# Altium schematic sheet 04_VOLTAGE_CONVERTER.SchDoc: =TitleParameter
size A3; Address: Crete IL; Organization: ASISGUARD; Address1: Kemalpasa, Kemalpasa Cd. No:290 D:292H, 35060 Bornova/Izmir/Turkey
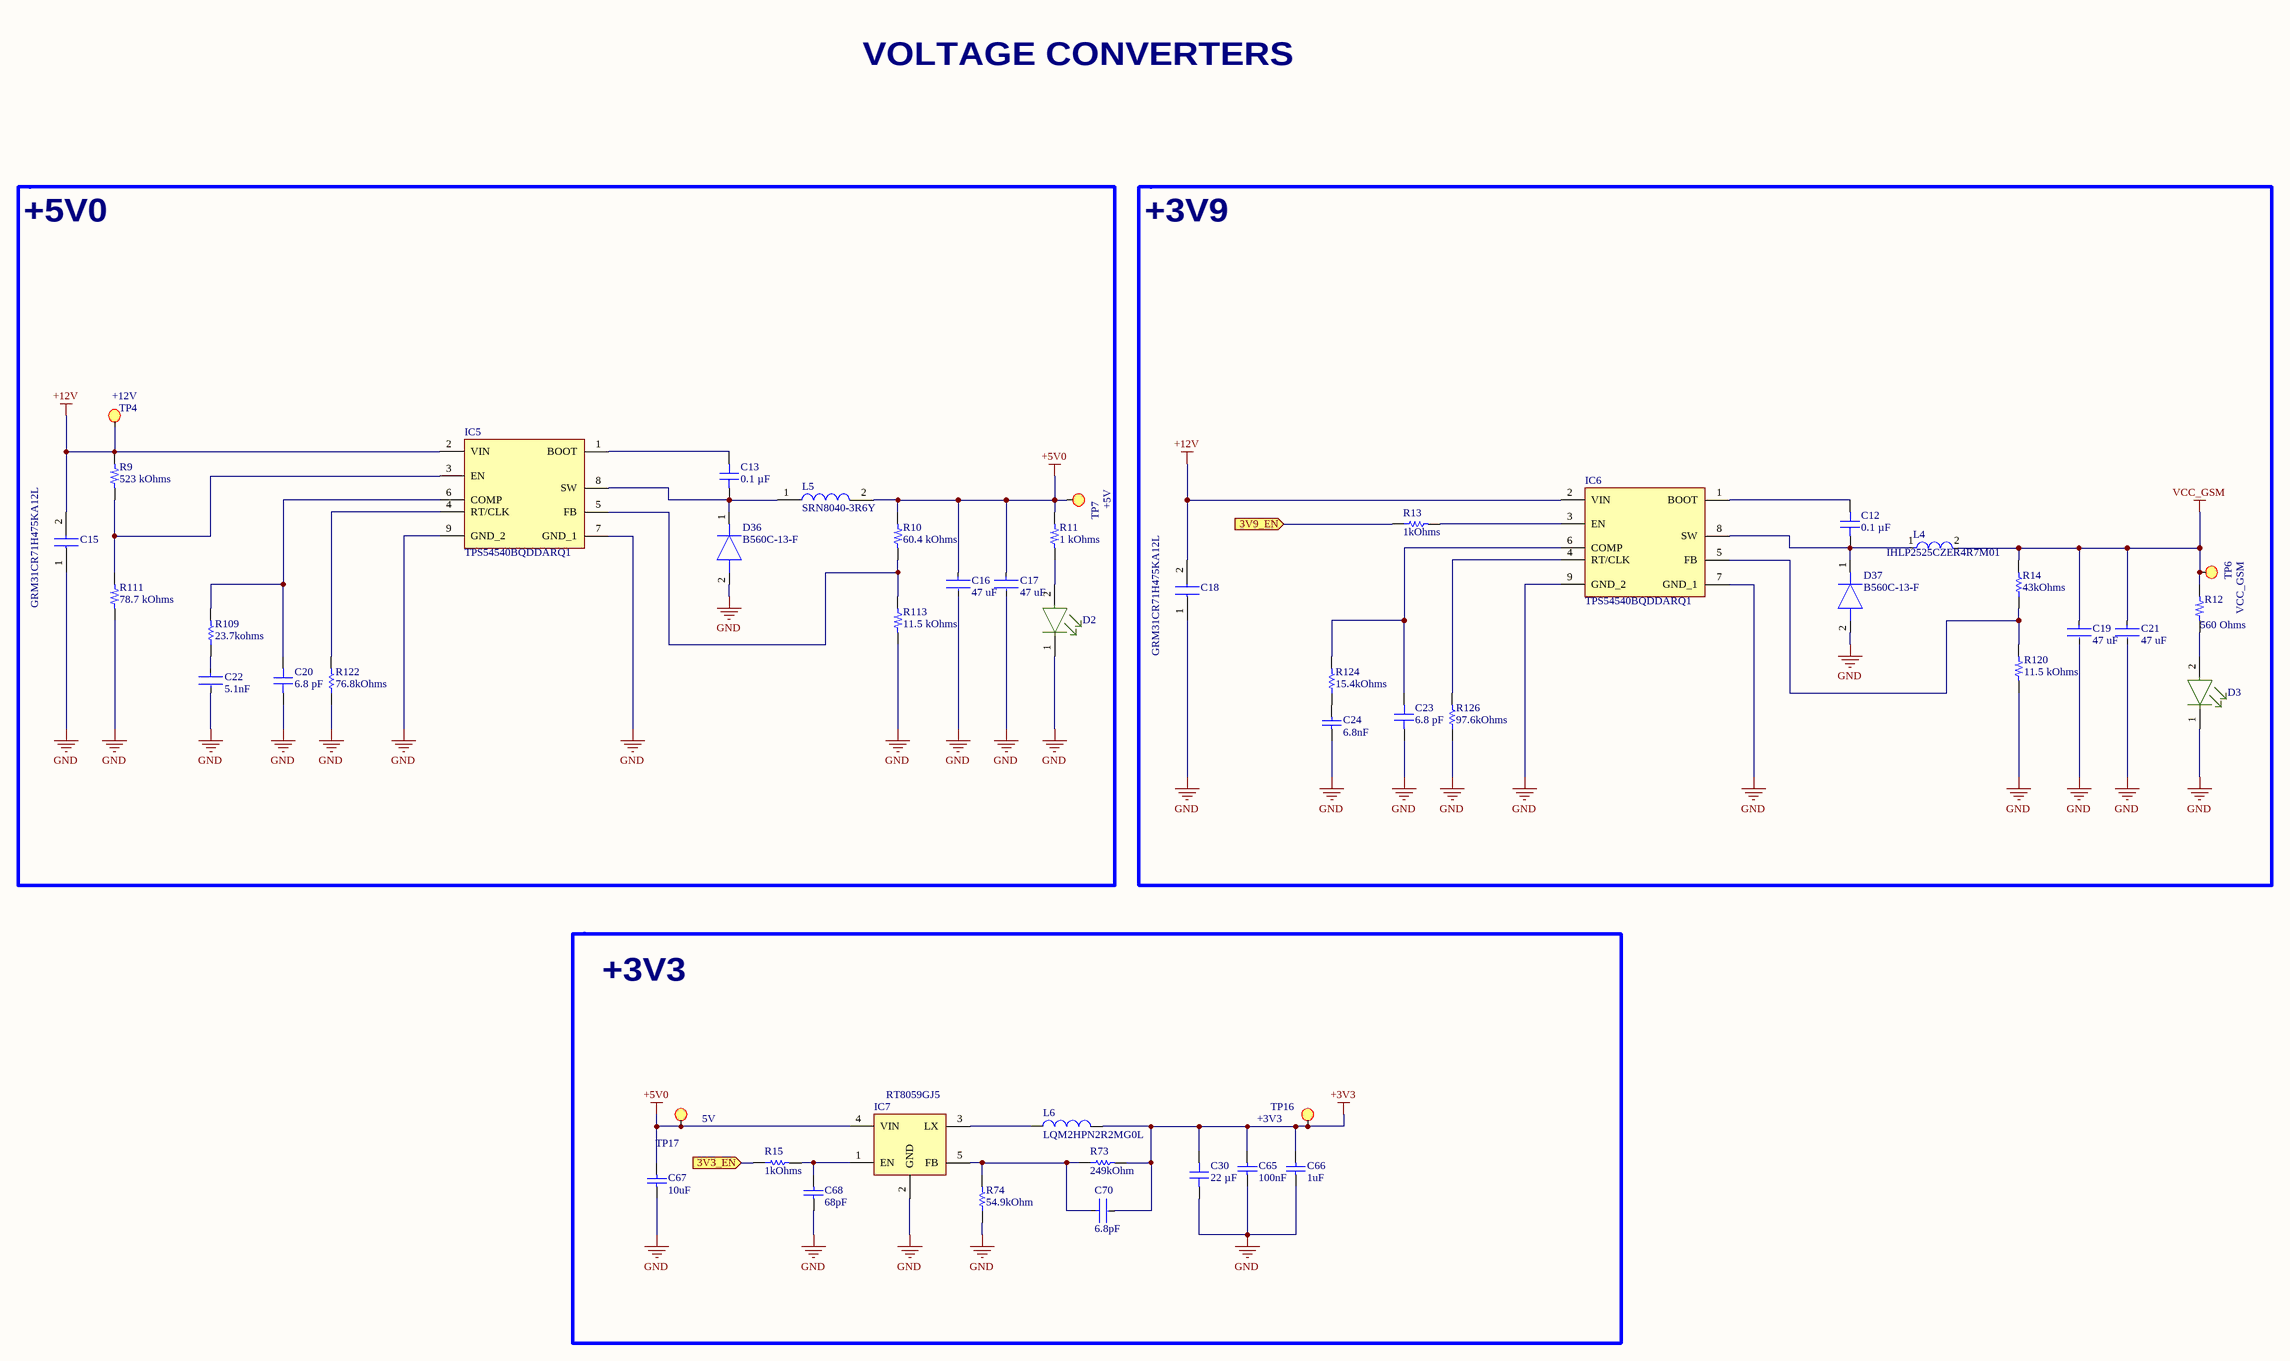
[diagram p0: 04_VOLTAGE_CONVERTER.SchDoc]

## Parts
C12  0.1 µF  [CAP0402(1005)X0.5]
C13  0.1 µF  [CAP0402(1005)X0.5]
C15  GRM31CR71H475KA12L  [CAPC3216X180N]
C16  47 uF  [FP-GRM32E-0_3-0_2-IPC_C]
C17  47 uF  [FP-GRM32E-0_3-0_2-IPC_C]
C18  GRM31CR71H475KA12L  [CAPC3216X180N]
C19  47 uF  [FP-GRM32E-0_3-0_2-IPC_C]
C20  6.8 pF  [CAP0603]
C21  47 uF  [FP-GRM32E-0_3-0_2-IPC_C]
C22  5.1nF  [FP-C0603C-CF-MFG]
C23  6.8 pF  [CAP0603]
C24  6.8nF  [CAPC1608X90X35NL10T15]
C30  22 µF  [CAP1206]
C65  100nF  [CAP0603]
C66  1uF  [CAP0603]
C67  10uF  [CAP0603]
C68  68pF  [CAP0603]
C70  6.8pF  [FP-C0603C-CF-MFG]
D2  LED GREEN CLEAR SMD  [Lite-On_GREEN_MFG]  (value not drawn)
D3  LED GREEN CLEAR SMD  [Lite-On_GREEN_MFG]  (value not drawn)
D36  B560C-13-F  [DIOM7959X250N]
D37  B560C-13-F  [DIOM7959X250N]
IC5  TPS54540BQDDARQ1  [SOIC127P600X170-9N]
IC6  TPS54540BQDDARQ1  [SOIC127P600X170-9N]
IC7  RT8059GJ5  [SOT94P280X100-5N]
L4  IHLP2525CZER4R7M01  [FP-IHLP-2525CZ-FP_2_413x3-MFG]
L5  SRN8040-3R6Y  [SRN8040-3R3Y]
L6  LQM2HPN2R2MG0L  [INDC2520X100N]
R9  523 kOhms  [RES0402(1005)]
R10  60.4 kOhms  [RES0402(1005)]
R11  1 kOhms  [RES 0603_1608]
R12  560 Ohms  [RES 0402_1005]
R13  1kOhms  [RESC1005X40X25LL05T10]
R14  43kOhms  [RESC1005X40X25NL05T05]
R15  1kOhms  [RESC1005X40X25LL05T10]
R73  249kOhm  [RESC1005X40X25NL05T05]
R74  54.9kOhm  [RESC1005X40X25LL05T10]
R109  23.7kohms  [RESC1005X40X25ML05T05]
R111  78.7 kOhms  [RES0402(1005)]
R113  11.5 kOhms  [RES0402(1005)]
R120  11.5 kOhms  [RES0402(1005)]
R122  76.8kOhms  [RESC1609X50X30ML10T20]
R124  15.4kOhms  [RESC1005X40X25ML05T05]
R126  97.6kOhms  [RESC1005X40X25ML05T10]
TP4  +12V  [TEST_POINT_SMD]
TP6  VCC_GSM  [TEST_POINT_SMD]
TP7  +5V  [TEST_POINT_SMD]
TP16  +3V3  [TEST_POINT_SMD]
TP17  5V  [TEST_POINT_SMD]

## Blocks framed on the sheet
+5V0: C13 C15-C17 C20 C22 D2 D36 IC5 L5 R9-R11 R109 R111 R113 R122 TP4 TP7
+3V9: C12 C18 C19 C21 C23 C24 D3 D37 IC6 L4 R12-R14 R120 R124 R126 TP6
+3V3: C30 C65-C68 C70 IC7 L6 R15 R73 R74 TP16 TP17

## Ports
3V3_EN (in), 3V9_EN (in)

## Nets
+3V3: C30.2 C65.2 C66.2 C70.2 L6.2 R73.2 TP16.1(TP)
+5V0: C16.1 C17.1 C67.1 IC7.4(VIN) L5.2 R10.2 R11.2 TP7.1(TP) TP17.1(TP)
+12V: C15.2 C18.2 IC5.2(VIN) IC6.2(VIN) R9.2 TP4.1(TP)
GND: C15.1 C16.2 C17.2 C18.1 C19.2 C20.1 C21.2 C22.2 C23.1 C24.1 C30.1 C65.1 C66.1 C67.2 C68.2 D2.1(C) D3.1(C) D36.2(A) D37.2(A) IC5.7(GND_1) IC5.9(GND_2) IC6.7(GND_1) IC6.9(GND_2) IC7.2(GND) R74.1 R111.1 R113.1 R120.1 R122.1 R126.1
VCC_GSM: C19.1 C21.1 L4.2 R12.2 R14.2 TP6.1(TP)
3V3_EN: R15.1 ; port 3V3_EN
3V9_EN: R13.1 ; port 3V9_EN
NetC12_1: C12.1 D37.1(K) IC6.8(SW) L4.1
NetC12_2: C12.2 IC6.1(BOOT)
NetC13_1: C13.1 D36.1(K) IC5.8(SW) L5.1
NetC13_2: C13.2 IC5.1(BOOT)
NetC20_2: C20.2 IC5.6(COMP) R109.2
NetC22_1: C22.1 R109.1
NetC23_2: C23.2 IC6.6(COMP) R124.2
NetC24_2: C24.2 R124.1
NetC68_1: C68.1 IC7.1(EN) R15.2
NetC70_1: C70.1 IC7.5(FB) R73.1 R74.2
NetD2_2: D2.2(A) R11.1
NetD3_2: D3.2(A) R12.1
NetIC5_3: IC5.3(EN) R9.1 R111.2
NetIC5_4: IC5.4(RT/CLK) R122.2
NetIC5_5: IC5.5(FB) R10.1 R113.2
NetIC6_3: IC6.3(EN) R13.2
NetIC6_4: IC6.4(RT/CLK) R126.2
NetIC6_5: IC6.5(FB) R14.1 R120.2
NetIC7_3: IC7.3(LX) L6.1

## Notes on the sheet
- VOLTAGE CONVERTERS
- Proje/Project:
- Sayfa Adı/Document Name:
- Çizilme Tarihi/Drawing Date
- Umit KAYACIK
- Tasarlayan/Designed By
- Sayfa/Sheet:
- Revision:
- of
- Son Güncelleme/Last Edit Date
- Kontrol eden/Checked By
- Onaylayan/Approved By
- Boyut/Size:
- Varyant/Variant:
- Dil/Language:
- A3
- ENG

## Library data of the parts
C12 C13 = C0402C104K4RECAUTO: CAP CER 0402 0.1UF 16V X7R 10%; manufacturer: KEMET; Part Number: C0402C104K4RECAUTO; Value: 0.1 µF; Applications: Automotive, ESD Protection; Capacitance: 0.1 µF; componentlink1description: Datasheet; componentlink1url: https://api.kemet.com/component-edge/download/datasheet/C0402C104K4RECAUTO.pdf; componentlink2description: DigiKey Link; componentlink2url: https://www.digikey.com/en/products/detail/kemet/C0402C104K4RECAUTO/8563695; Device Package: 0402 (1005 Metric); lastupdated: 2/9/2024 8:04:38 PM; Lifecycle Status: Active; Minimum Order: 1; Mounting Type: Surface Mount, MLCC; Operating Temperature: -55°C ~ 125°C; Package / Case: 0402 (1005 Metric); packaging: TapeAndReel; partid: 1731; Part Status: Active; price: 0.01; Ratings: AEC-Q200; series: ESD SMD Auto X7R; Size / Dimension: 0.039" L x 0.020" W (1.00mm x 0.50mm); Supplier 1: DigiKey; Supplier Part Number 1: 399-17167-1-ND; Temperature Coefficient: X7R; Thickness (Max): 0.022" (0.55mm); Tolerance: ±10%; Voltage - Rated: 16V
C15 C18 = GRM31CR71H475KA12L: Capacitor; Manufacturer_Name: Murata Electronics; Datasheet Link: https://search.murata.co.jp/Ceramy/image/img/A01X/G101/ENG/GRM31CR71H475KA12-01A.pdf; Height: 1.8mm; Manufacturer_Part_Number: GRM31CR71H475KA12L; Mouser Part Number: 81-GRM31CR71H475KA2L; Mouser Price/Stock: https://www.mouser.co.uk/ProductDetail/Murata-Electronics/GRM31CR71H475KA12L?qs=QOxk%252BkhTc6I%252BVQUsJuOHog%3D%3D; Arrow Part Number: GRM31CR71H475KA12L; Arrow Price/Stock: https://www.arrow.com/en/products/grm31cr71h475ka12l/murata-manufacturing?utm_currency=USD&region=nac
C16 C17 C19 C21 = CMP-2000-06362-2: CAP CER 47UF 16V X5R 1210; Part Number: GRM32ER61C476KE15L; Tolerance: 10%; Material: Ceramic; Case Code (Metric): 3225; RoHS Compliant: Yes; Min Operating Temperature: -55°C; Radiation Hardening: No; Voltage: 16V; Package Quantity: 1; Case Code (Imperial): 1210; REACH SVHC: No SVHC; Capacitance: 47uF; Voltage Rating (DC): 16V; Dielectric: X5R; Case/Package: 1210; Length: 3.2mm; Voltage Rating: 16V; Packaging: Cut Tape; Width: 0.098inch; Number of Pins: 2; Lead Free: Lead Free; Height: 2.5mm; Mount: Surface Mount; Termination: SMD/SMT; Max Operating Temperature: 85°C; Thickness: 0.106inch; Depth: 2.5mm
C20 C23 = 06031U6R8BAT2A: CAP CER 6.8PF 100V NP0 0603; manufacturer: KYOCERA AVX; Temperature Coefficient: C0G, NP0; Tolerance: ±0.1pF; Part Number: 06031U6R8BAT2A; Value: 6.8 pF; Applications: RF, Microwave, High Frequency; Capacitance: 6.8 pF; componentlink1description: Datasheet; componentlink1url: https://datasheets.kyocera-avx.com/U-Series.pdf; componentlink2description: DigiKey Link; componentlink2url: https://www.digikey.com/en/products/detail/kyocera-avx/06031U6R8BAT2A/1598953; Device Package: 0603 (1608 Metric); Features: Ultra Low ESR; lastupdated: 2/9/2024 8:09:59 PM; Lifecycle Status: Active; Minimum Order: 1; Mounting Type: Surface Mount, MLCC; Operating Temperature: -55°C ~ 125°C; Package / Case: 0603 (1608 Metric); packaging: TapeAndReel; partid: 35837; Part Status: Active; price: 0.05; series: U; Size / Dimension: 0.060" L x 0.030" W (1.52mm x 0.76mm); Supplier 1: DigiKey; Supplier Part Number 1: 478-06031U6R8BAT2ACT-ND; Thickness (Max): 0.036" (0.91mm); Voltage - Rated: 100V
C22 = CMP-1035-02216-3: CAP CER 5100PF 50V C0G/NP0 0603; Manufacturer: KEMET; Manufacturer Part Number: C0603C512J5GACTU; Tolerance: 0.05; Material: Ceramic; Value: 5,100 pF; Temperature Characteristic: C0G; Temperature Coefficient: 30ppm/°C; Automotive Grade: Grade 1; Mouser Description: Multilayer Ceramic Capacitors MLCC - SMD/SMT 50volts 5100pF 5% C0G; Lead Free: Yes; Digikey Description: CAP CER 5100PF 50V C0G/NP0 0603; ComponentLink2URL: https://api.kemet.com/component-edge/download/datasheet/C0603C100J5GACAUTO.pdf; Octopart: https://octopart.com/c0603c512j5gactu-kemet-19757382; Device Class L2: Capacitors; Automotive: Yes; ComponentLink2Description: Datasheet; Voltage Rating: 50 V; Temperature Range High: +125°C; Temperature Range Low: -55°C; RoHS: TRUE; Capacitance: 5,100 pF; Temperature: -55°C to +125°C; Package: C0603C-CF; Device Class L1: Passive Components; Height: 0.87mm; Device Class L3: Ceramic Capacitors; Category: Cap; Part Number: C0603C512J5GACTU
C24 = CMP-2006-02958-1: Part Number: GRM188R72A682KA01D; Manufacturer: Murata
C30 = CL31A226KAHNNNE: CAP CER 22UF 25V X5R 1206; manufacturer: Samsung Electro-Mechanics; Tolerance: ±10%; Part Number: CL31A226KAHNNNE; Value: 22 µF; Applications: General Purpose; Capacitance: 22 µF; componentlink1description: Datasheet; componentlink1url: http://www.samsungsem.com/kr/support/product-search/mlcc/CL31A226KAHNNNE.jsp; componentlink2description: DigiKey Link; componentlink2url: https://www.digikey.com/en/products/detail/samsung-electro-mechanics/CL31A226KAHNNNE/3888705; Device Package: 1206 (3216 Metric); lastupdated: 3/11/2024 7:11:00 AM; Lifecycle Status: Active; Minimum Order: 1; Mounting Type: Surface Mount, MLCC; Operating Temperature: -55°C ~ 85°C; Package / Case: 1206 (3216 Metric); packaging: TapeAndReel; partid: 22185; Part Status: Active; price: 0.07; series: CL; Size / Dimension: 0.126" L x 0.063" W (3.20mm x 1.60mm); Supplier 1: DigiKey; Supplier Part Number 1: 1276-3047-1-ND; Temperature Coefficient: X5R; Thickness (Max): 0.071" (1.80mm); Voltage - Rated: 25V
C65 = CAP0603_100nF: CAP CER 0.1UF 50V X7R 0603; Part Number: C0603C104K5RACTU; Value: 100nF 50V; Order Code: DIGI : 399-5089-1-ND
C66 = CAP0603_100nF: CAP CER 1uF 25V X7R 0603; Part Number: CGA3E1X7R1E105K080AE; Value: 1uF 25V; Order Code: DIGI : 445-173628-2-ND
C67 = CAP0603_100nF: Ceramic Capacitor,10uF,16V,+/-20%,X5R,0603,Samsung; P/N: CL10A106MONQNC; Value: 10uF 16V
C68 = CAP0603_100nF: 68 pF ±2% 50V Ceramic Capacitor C0G, NP0 0603 (1608 Metric); Part Number: 06035A680GAT2A; Value: 68pF 50V; Order Code: DIGI : 478-10332-2-ND
C70 = CMP-2006-03271-2: CAP CER 6.8PF 50V NP0 0603; Manufacturer Part Number: C0603C689C5GACTU; Manufacturer: KEMET; Automotive Grade: Grade 1; Temperature Coefficient: 30ppm/°C; Temperature Characteristic: C0G; Tolerance: 0.25 pF; Material: Ceramic; ComponentLink2URL: https://api.kemet.com/component-edge/download/datasheet/C0603C100J5GACAUTO.pdf; Mouser Description: 0603 C 6.8pF Ceramic Multilayer Capacitor; 50V dc; +125C; C0G Dielectric; +/-0.25pF; Temperature Range High: +125°C; Device Class L1: Passive Components; Temperature: -55°C to +125°C; Digikey Description: CAP CER 6.8PF 50V NP0 0603; Device Class L2: Capacitors; Automotive: Yes; Octopart: https://octopart.com/c0603c689c5gactu-kemet-8718591; Category: Cap; ComponentLink2Description: Datasheet; RoHS: TRUE; Capacitance: 6.8 pF; Value: 6.8 pF; Lead Free: Yes; Device Class L3: Ceramic Capacitors; Package: C0603C-CF; Voltage Rating: 50 V; Temperature Range Low: -55°C; Height: 0.87mm; Part Number: C0603C689C5GACTU
D2 D3 = LTST-C191KGKT: Green 571nm LED Indication - Discrete 2V 0603 (1608 Metric); Manufacturer Part Number: 150060VS75000; Order Code: 150060VS75000; LCSC Manufacturer Part Number: 150060VS75000; LCSC Part Number: 150060VS75000
D36 D37 = B560C-13-F: Manufacturer_Name: Diodes Incorporated; Datasheet Link: https://datasheet.lcsc.com/szlcsc/Diodes-Incorporated-B560C-13-F_C85100.pdf; Height: 2.5mm; Manufacturer_Part_Number: B560C-13-F; Mouser Part Number: 621-B560C-F; Mouser Price/Stock: https://www.mouser.co.uk/ProductDetail/Diodes-Incorporated/B560C-13-F?qs=OC0R%252Bhozcm%252BAsjMXklZLIw%3D%3D; Arrow Part Number: B560C-13-F; Arrow Price/Stock: https://www.arrow.com/en/products/b560c-13-f/diodes-incorporated?utm_currency=USD&region=nac
IC5 IC6 = TPS54540BQDDARQ1: Integrated Circuit; Manufacturer_Name: Texas Instruments; Datasheet Link: http://www.ti.com/lit/gpn/tps54540b-q1; Height: 1.7mm; Manufacturer_Part_Number: TPS54540BQDDARQ1; Mouser Part Number: 595-TPS54540BQDDARQ1; Mouser Price/Stock: https://www.mouser.co.uk/ProductDetail/Texas-Instruments/TPS54540BQDDARQ1?qs=Mv7BduZupUh5p%252BrvdCEqBg%3D%3D; Arrow Part Number: TPS54540BQDDARQ1; Arrow Price/Stock: https://www.arrow.com/en/products/tps54540bqddarq1/texas-instruments?utm_currency=USD&region=nac
IC7 = RT8059GJ5: Integrated Circuit; Manufacturer_Name: RICHTEK; Datasheet Link: http://www.farnell.com/datasheets/1756324.pdf; Height: 1mm; Manufacturer_Part_Number: RT8059GJ5
L4 = CMP-02424-000538-1: Commercial Inductors, High Saturation Series 4.7uH 5.5A 40mΩ 20%; DC Resistance (DCR): 40mR; Max DC Current: 10A; Shielding: Shielded; Test Frequency: 100kHz; Self Resonant Frequency: 5MHz; Core Material: Metal; Height: 3mm; Depth: 6.72mm; Inductance Tolerance: 20%; Inductance: 4.7uH; Number of Pins: 2; Military Standard: Not; Min Operating Temperature: -55°C; Mount: Surface Mount; Saturation Current: 10A; Case/Package: 2525; Case Code (Metric): 6363; Packaging: Tape and Reel; Width: 0.255inch; Current Rating: 5.5A; Package Quantity: 2000; Termination: SMD/SMT; Case Code (Imperial): 2525; Lead Free: Lead Free; Contact Plating: Tin; Max Operating Temperature: 125°C; Tolerance: 20%; Length: 7.24mm; Radiation Hardening: No; Height - Seated (Max): 0.118inch; RMS Current (Irms): 5.5A
L5 = SRN8040-3R3Y: Inductor; Manufacturer_Name: Bourns; Datasheet Link: http://www.bourns.com/data/global/pdfs/SRN8040.pdf; Manufacturer_Part_Number: SRN8040-3R6Y; Mouser Part Number: SRN8040-3R6Y
L6 = LQM2HPN2R2MG0L: Inductor Power Chip Shielded Multi-Layer 2.2uH 20% 1MHz Ferrite 1.3A 100mOhm DCR 1008 T/R
R9 = CRCW0402523KFKED: RES SMD 523K OHM 1% 1/16W 0402; Manufacturer: Vishay Dale; Power (Watts): 0.063W, 1/16W; Temperature Coefficient: ±100ppm/°C; Part Number: CRCW0402523KFKED; Value: 523 kOhms; ComponentLink1Description: Datasheet; ComponentLink1URL: http://www.vishay.com/docs/20035/dcrcwe3.pdf; ComponentLink2Description: DigiKey Link; ComponentLink2URL: https://www.digikey.com/en/products/detail/vishay-dale/CRCW0402523KFKED/1178317; Composition: Thick Film; Device Package: 0402 (1005 Metric); Features: Automotive AEC-Q200; Height - Seated (Max): 0.016" (0.40mm); LastUpdated: 2/9/2024 8:29:43 PM; Lifecycle Status: Active; Minimum Order: 1; Number of Terminations: 2; Operating Temperature: -55°C ~ 155°C; Package / Case: 0402 (1005 Metric); Packaging: TapeAndReel; PartId: 14531; Part Status: Active; Price: 0.01; Ratings: AEC-Q200; Resistance: 523 kOhms; Series: CRCW; Size / Dimension: 0.039" L x 0.020" W (1.00mm x 0.50mm); Supplier 1: DigiKey; Supplier Part Number 1: 541-523KLCT-ND; Supplier Device Package: 0402; Tolerance: ±1%
R10 = CRCW040260K4FKED: RES SMD 60.4K OHM 1% 1/16W 0402; Manufacturer: Vishay Dale; Power (Watts): 0.063W, 1/16W; Temperature Coefficient: ±100ppm/°C; Part Number: CRCW040260K4FKED; Value: 60.4 kOhms; ComponentLink1Description: Datasheet; ComponentLink1URL: http://www.vishay.com/docs/20035/dcrcwe3.pdf; ComponentLink2Description: DigiKey Link; ComponentLink2URL: https://www.digikey.com/en/products/detail/vishay-dale/CRCW040260K4FKED/1178210; Composition: Thick Film; Device Package: 0402 (1005 Metric); Features: Automotive AEC-Q200; Height - Seated (Max): 0.016" (0.40mm); LastUpdated: 2/9/2024 8:29:40 PM; Lifecycle Status: Active; Minimum Order: 1; Number of Terminations: 2; Operating Temperature: -55°C ~ 155°C; Package / Case: 0402 (1005 Metric); Packaging: CutTape; PartId: 15537; Part Status: Active; Price: 0.01; Ratings: AEC-Q200; Resistance: 60.4 kOhms; Series: CRCW; Size / Dimension: 0.039" L x 0.020" W (1.00mm x 0.50mm); Supplier 1: DigiKey; Supplier Part Number 1: 541-60.4KLCT-ND; Supplier Device Package: 0402; Tolerance: ±1%
R11 = RNCP0603FTD1K00: RES 1K OHM 1% 1/8W 0603; Manufacturer: Stackpole Electronics Inc; Power (Watts): 0.125W, 1/8W; Temperature Coefficient: ±100ppm/°C; Part Number: RNCP0603FTD1K00; Value: 1 kOhms; ComponentLink1Description: Datasheet; ComponentLink1URL: https://www.seielect.com/catalog/sei-rncp.pdf; ComponentLink2Description: DigiKey Link; ComponentLink2URL: https://www.digikey.com/en/products/detail/stackpole-electronics-inc/RNCP0603FTD1K00/2240106; Composition: Thin Film; Device Package: 0603 (1608 Metric); Features: Anti-Sulfur; Height - Seated (Max): 0.022" (0.55mm); LastUpdated: 2/9/2024 8:43:33 PM; Lifecycle Status: Active; Minimum Order: 1; Number of Terminations: 2; Operating Temperature: -55°C ~ 155°C; Package / Case: 0603 (1608 Metric); Packaging: TapeAndReel; PartId: 5694; Part Status: Active; Price: 0.01; Resistance: 1 kOhms; Series: RNCP; Size / Dimension: 0.061" L x 0.031" W (1.55mm x 0.80mm); Supplier 1: DigiKey; Supplier Part Number 1: RNCP0603FTD1K00CT-ND; Supplier Device Package: 0603; Tolerance: ±1%
R12 = ESR01MZPF5600: ANTI-SURGE CHIP RESISTORS; Part Number: ESR01MZPF5600; Value: 560 Ohms
R13 R15 = CMP-2002-03045-1: Part Number: CRCW04021K00FKEDHP; Manufacturer: Vishay Dale
R14 = CMP-2002-00002-1: Part Number: CRCW040243K0FKED; Manufacturer: Vishay Dale
R73 = CMP-2002-08401-1: Part Number: CRCW0402249KFKED; Manufacturer: Vishay Dale
R74 = CMP-2002-07133-1: Part Number: RC0402FR-0754K9L; Manufacturer: Yageo / Phycomp
R109 = CMP-1011-00663-2: RES SMD 23.7K OHM 1% 1/16W 0402; Part Number: CRCW040223K7FKED; Manufacturer: Vishay Dale
R111 = CRCW040290K9FKED: RES SMD 78.7K OHM 1% 1/16W 0402; Part Number: CRCW040278K7FKED; Power (Watts): 0.063W, 1/16W; Resistance: 90.9 kOhms; Temperature Coefficient: ±100ppm/°C; Value: 78.7 kOhms; Composition: Thick Film; Device Package: 0402 (1005 Metric); Height - Seated (Max): 0.016" (0.40mm); LastUpdated: 2/9/2024 8:29:54 PM; Lifecycle Status: Active; Minimum Order: 1; Number of Terminations: 2; Operating Temperature: -55°C ~ 155°C; Package / Case: 0402 (1005 Metric); Packaging: TapeAndReel; Part Status: Active; Price: 0.01; Series: CRCW; Size / Dimension: 0.039" L x 0.020" W (1.00mm x 0.50mm); Supplier Device Package: 0402; Tolerance: ±1%
R113 R120 = CRCW040211K5FKED: RES SMD 11.5K OHM 1% 1/16W 0402; Manufacturer: Vishay Dale; Power (Watts): 0.063W, 1/16W; Temperature Coefficient: ±100ppm/°C; Part Number: CRCW040211K5FKED; Value: 11.5 kOhms; ComponentLink1Description: Datasheet; ComponentLink1URL: http://www.vishay.com/docs/20035/dcrcwe3.pdf; ComponentLink2Description: DigiKey Link; ComponentLink2URL: https://www.digikey.com/en/products/detail/vishay-dale/CRCW040211K5FKED/1178127; Composition: Thick Film; Device Package: 0402 (1005 Metric); Features: Automotive AEC-Q200; Height - Seated (Max): 0.016" (0.40mm); LastUpdated: 7/12/2023 7:23:57 PM; Lifecycle Status: Active; Minimum Order: 1; Number of Terminations: 2; Operating Temperature: -55°C ~ 155°C; Package / Case: 0402 (1005 Metric); Packaging: CutTape; PartId: 10330; Part Status: Active; Price: 0.01; Ratings: AEC-Q200; Resistance: 11.5 kOhms; Series: CRCW; Size / Dimension: 0.039" L x 0.020" W (1.00mm x 0.50mm); Supplier 1: DigiKey; Supplier Part Number 1: 541-11.5KLCT-ND; Supplier Device Package: 0402; Tolerance: ±1%
R122 = CMP-1012-00723-2: Part Number: CRCW060376K8FKEA; Manufacturer: Vishay Dale
R124 = CMP-2002-08222-1: Manufacturer: Vishay Dale; Part Number: CRCW040215K4FKED
R126 = CMP-2002-07845-1: Manufacturer: Yageo; Part Number: RC0402FR-0797K6L
TP4 TP6 TP7 TP16 TP17 = TP: DESIG: testing PAD; FAB: NA; VAL: NOT POPULATED; PCB Footprint: test0_8-smd; REF: NA